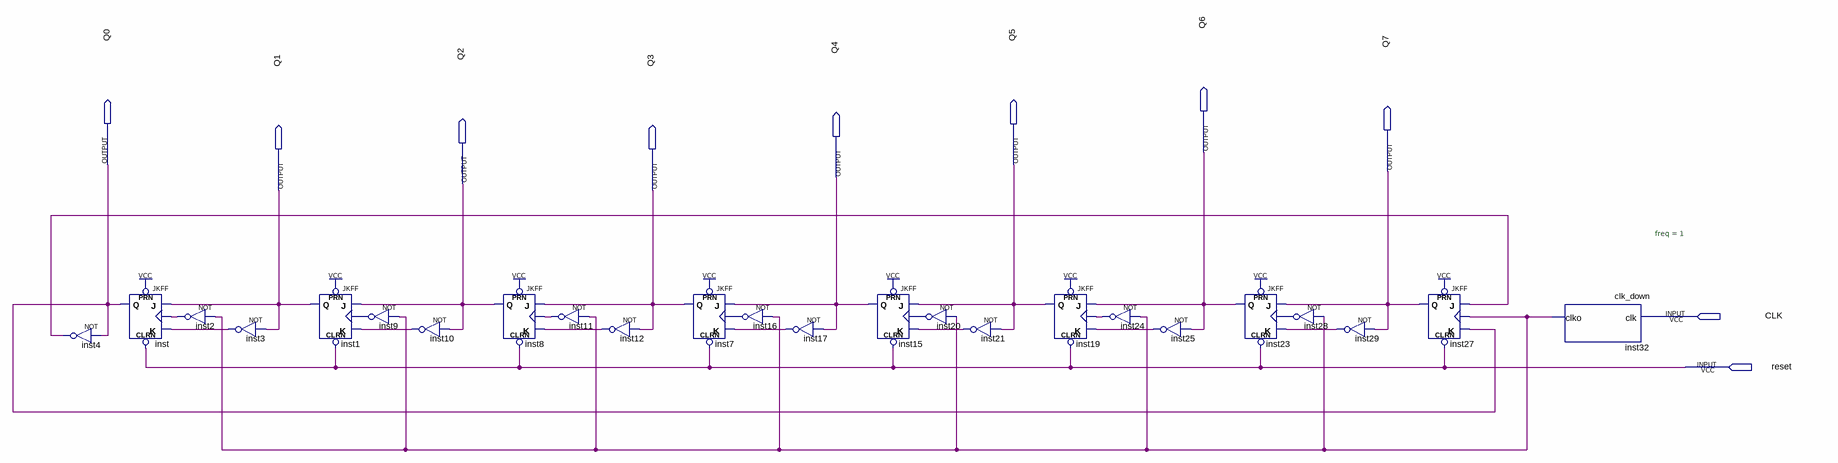
[diagram p0: schematic sheet]
// Quartus schematic Johnsoncounter.bdf as structural Verilog: 24 symbols, 10 pins
module Johnsoncounter (
  input  CLK,
  input  reset,
  output Q6,
  output Q0,
  output Q5,
  output Q7,
  output Q4,
  output Q2,
  output Q1,
  output Q3
);

  wire inst2_out, inst3_out, inst4_out, inst9_out, inst10_out, inst11_out, inst12_out, inst16_out,
       inst17_out, inst20_out, inst21_out, inst24_out, inst25_out, inst28_out, inst29_out, inst32_clko;

  not inst4 (inst4_out, Q0);
  JKFF inst (.PRN(1'b1), .CLRN(reset), .K(inst3_out), .J(Q1), .CLK(inst2_out), .Q(Q0));
  not inst2 (inst2_out, inst32_clko);
  not inst3 (inst3_out, Q1);
  JKFF inst1 (.PRN(1'b1), .CLRN(reset), .K(inst10_out), .J(Q2), .CLK(inst9_out), .Q(Q1));
  not inst9 (inst9_out, inst32_clko);
  not inst10 (inst10_out, Q2);
  JKFF inst8 (.PRN(1'b1), .CLRN(reset), .K(inst12_out), .J(Q3), .CLK(inst11_out), .Q(Q2));
  not inst11 (inst11_out, inst32_clko);
  not inst12 (inst12_out, Q3);
  JKFF inst7 (.PRN(1'b1), .CLRN(reset), .K(inst17_out), .J(Q4), .CLK(inst16_out), .Q(Q3));
  not inst16 (inst16_out, inst32_clko);
  not inst17 (inst17_out, Q4);
  JKFF inst15 (.PRN(1'b1), .CLRN(reset), .K(inst21_out), .J(Q5), .CLK(inst20_out), .Q(Q4));
  not inst20 (inst20_out, inst32_clko);
  not inst21 (inst21_out, Q5);
  JKFF inst19 (.PRN(1'b1), .CLRN(reset), .K(inst25_out), .J(Q6), .CLK(inst24_out), .Q(Q5));
  not inst24 (inst24_out, inst32_clko);
  not inst25 (inst25_out, Q6);
  JKFF inst23 (.PRN(1'b1), .CLRN(reset), .K(inst29_out), .J(Q7), .CLK(inst28_out), .Q(Q6));
  not inst28 (inst28_out, inst32_clko);
  not inst29 (inst29_out, Q7);
  JKFF inst27 (.PRN(1'b1), .CLRN(reset), .K(Q0), .J(inst4_out), .CLK(inst32_clko), .Q(Q7));
  clk_down #(.freq(1)) inst32 (.clk(CLK), .clko(inst32_clko));
endmodule
